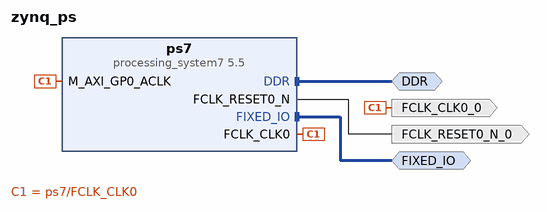
[diagram p0: block diagram of the top level]
# Vivado block design zynq_ps, xc7z010clg400-1, Vivado 2019.2
create_bd_design zynq_ps

create_bd_intf_port -mode Master -vlnv xilinx.com:interface:ddrx_rtl:1.0 DDR
create_bd_intf_port -mode Master -vlnv xilinx.com:display_processing_system7:fixedio_rtl:1.0 FIXED_IO
create_bd_port -dir O -type clk FCLK_CLK0_0
create_bd_port -dir O -type rst FCLK_RESET0_N_0

create_bd_cell -type ip -vlnv xilinx.com:ip:processing_system7:5.5 ps7
set_property -dict [list \
  CONFIG.PCW_FPGA0_PERIPHERAL_FREQMHZ 50 \
  CONFIG.PCW_QSPI_GRP_SINGLE_SS_ENABLE 1 \
  CONFIG.PCW_QSPI_GRP_SINGLE_SS_IO {MIO 1 .. 6} \
  CONFIG.PCW_QSPI_PERIPHERAL_ENABLE 1 \
  CONFIG.PCW_QSPI_QSPI_IO {MIO 1 .. 6} \
  CONFIG.PCW_SINGLE_QSPI_DATA_MODE x4 \
] [get_bd_cells ps7]
# 50 more settings of ps7 are not shown: defaults, MIO pin electricals, DDR timing, and values the tool derives

# ---- connections ----

connect_bd_intf_net [get_bd_intf_ports DDR] [get_bd_intf_pins ps7/DDR]
connect_bd_intf_net [get_bd_intf_ports FIXED_IO] [get_bd_intf_pins ps7/FIXED_IO]
connect_bd_net [get_bd_pins ps7/FCLK_CLK0] [get_bd_pins ps7/M_AXI_GP0_ACLK] [get_bd_ports FCLK_CLK0_0]
connect_bd_net [get_bd_pins ps7/FCLK_RESET0_N] [get_bd_ports FCLK_RESET0_N_0]

validate_bd_design
save_bd_design
